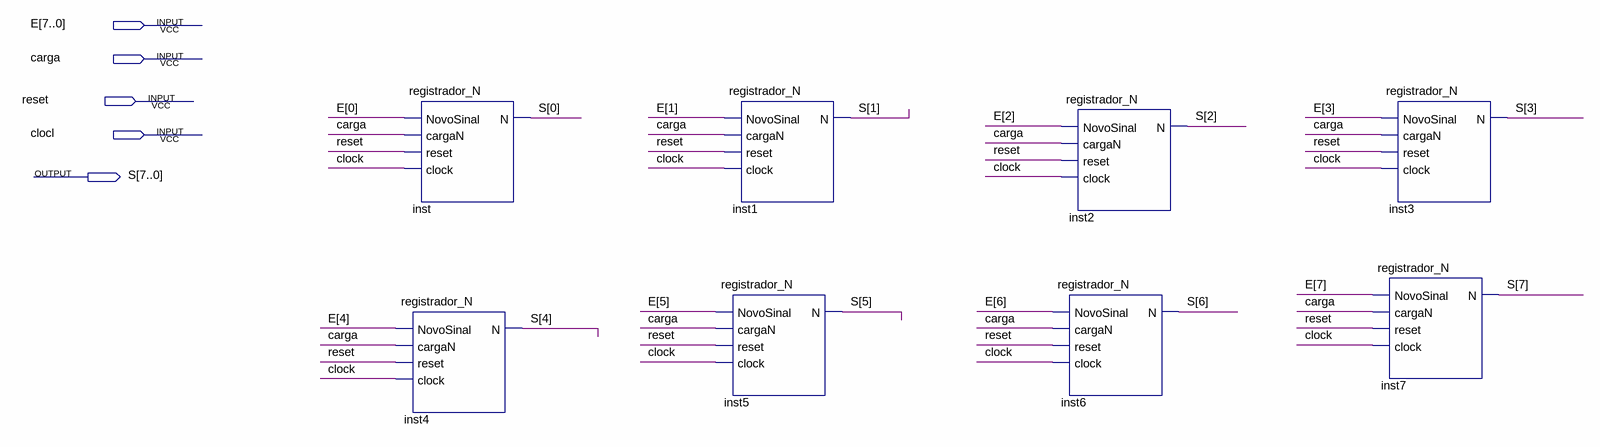
[diagram p0: schematic sheet]
// Quartus schematic registrador_8bits.bdf as structural Verilog: 8 symbols, 5 pins
module registrador_8bits (
  input  [7:0] E,
  input  carga,
  input  reset,
  input  clocl,
  output [7:0] S
);

  wire clock;

  registrador_N inst (.NovoSinal(E[0]), .cargaN(carga), .reset(reset), .clock(clock), .N(S[0]));
  registrador_N inst4 (.NovoSinal(E[4]), .cargaN(carga), .reset(reset), .clock(clock), .N(S[4]));
  registrador_N inst1 (.NovoSinal(E[1]), .cargaN(carga), .reset(reset), .clock(clock), .N(S[1]));
  registrador_N inst5 (.NovoSinal(E[5]), .cargaN(carga), .reset(reset), .clock(clock), .N(S[5]));
  registrador_N inst2 (.NovoSinal(E[2]), .cargaN(carga), .reset(reset), .clock(clock), .N(S[2]));
  registrador_N inst6 (.NovoSinal(E[6]), .cargaN(carga), .reset(reset), .clock(clock), .N(S[6]));
  registrador_N inst3 (.NovoSinal(E[3]), .cargaN(carga), .reset(reset), .clock(clock), .N(S[3]));
  registrador_N inst7 (.NovoSinal(E[7]), .cargaN(carga), .reset(reset), .clock(clock), .N(S[7]));
endmodule
